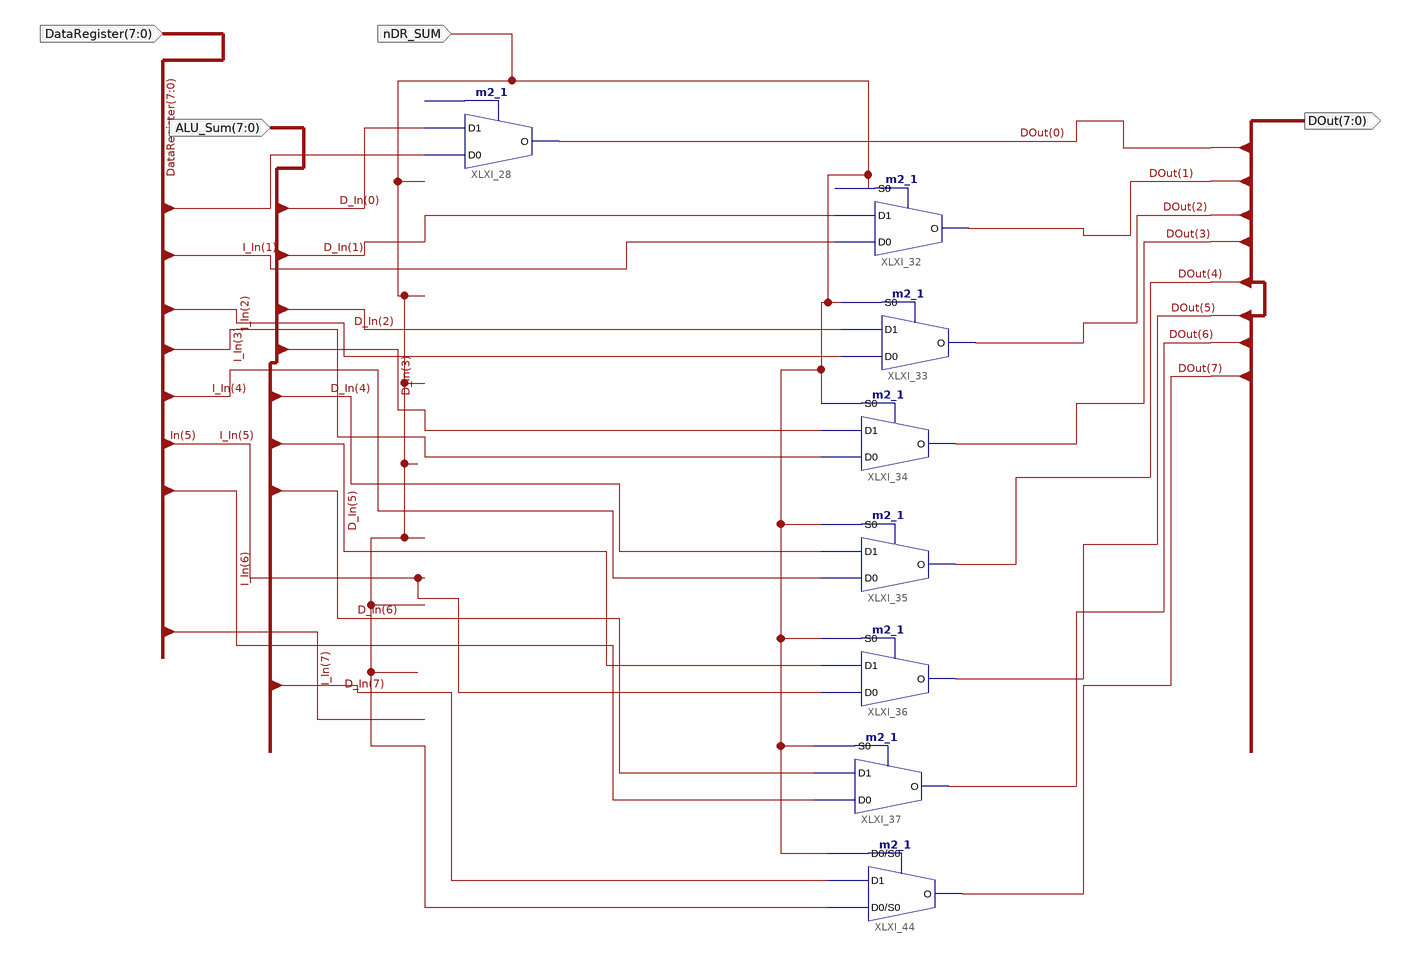
[diagram p0: schematic sheet 1]
// Xilinx ISE schematic MUX8_Accumulator.sch (spartan3e) as structural Verilog: 8 symbols, 4 ports
module MUX8_Accumulator (
  input  [7:0] ALU_Sum,
  input  [7:0] DataRegister,
  input  nDR_SUM,
  output [7:0] DOut
);

  wire [6:0] I_In;
  wire [7:0] D_In;

  m2_1 XLXI_28 (.D0(I_In[0]), .D1(D_In[0]), .O(DOut[0]));  // open: S0
  m2_1 XLXI_33 (.D0(I_In[2]), .D1(D_In[2]), .S0(nDR_SUM), .O(DOut[2]));
  m2_1 XLXI_34 (.D0(I_In[3]), .D1(D_In[3]), .S0(nDR_SUM), .O(DOut[3]));
  m2_1 XLXI_35 (.D0(I_In[4]), .D1(D_In[4]), .S0(nDR_SUM), .O(DOut[4]));
  m2_1 XLXI_36 (.D0(I_In[5]), .D1(D_In[5]), .S0(nDR_SUM), .O(DOut[5]));
  m2_1 XLXI_37 (.D0(I_In[6]), .D1(D_In[6]), .S0(nDR_SUM), .O(DOut[6]));
  m2_1 XLXI_32 (.D0(I_In[1]), .D1(D_In[1]), .S0(nDR_SUM), .O(DOut[1]));
  m2_1 XLXI_44 (.D0(nDR_SUM), .D1(D_In[7]), .S0(nDR_SUM), .O(DOut[7]));
endmodule
